# Altium schematic sheet Scaffold.SchDoc
size A3; SheetNumber: 1; SheetTotal: 7
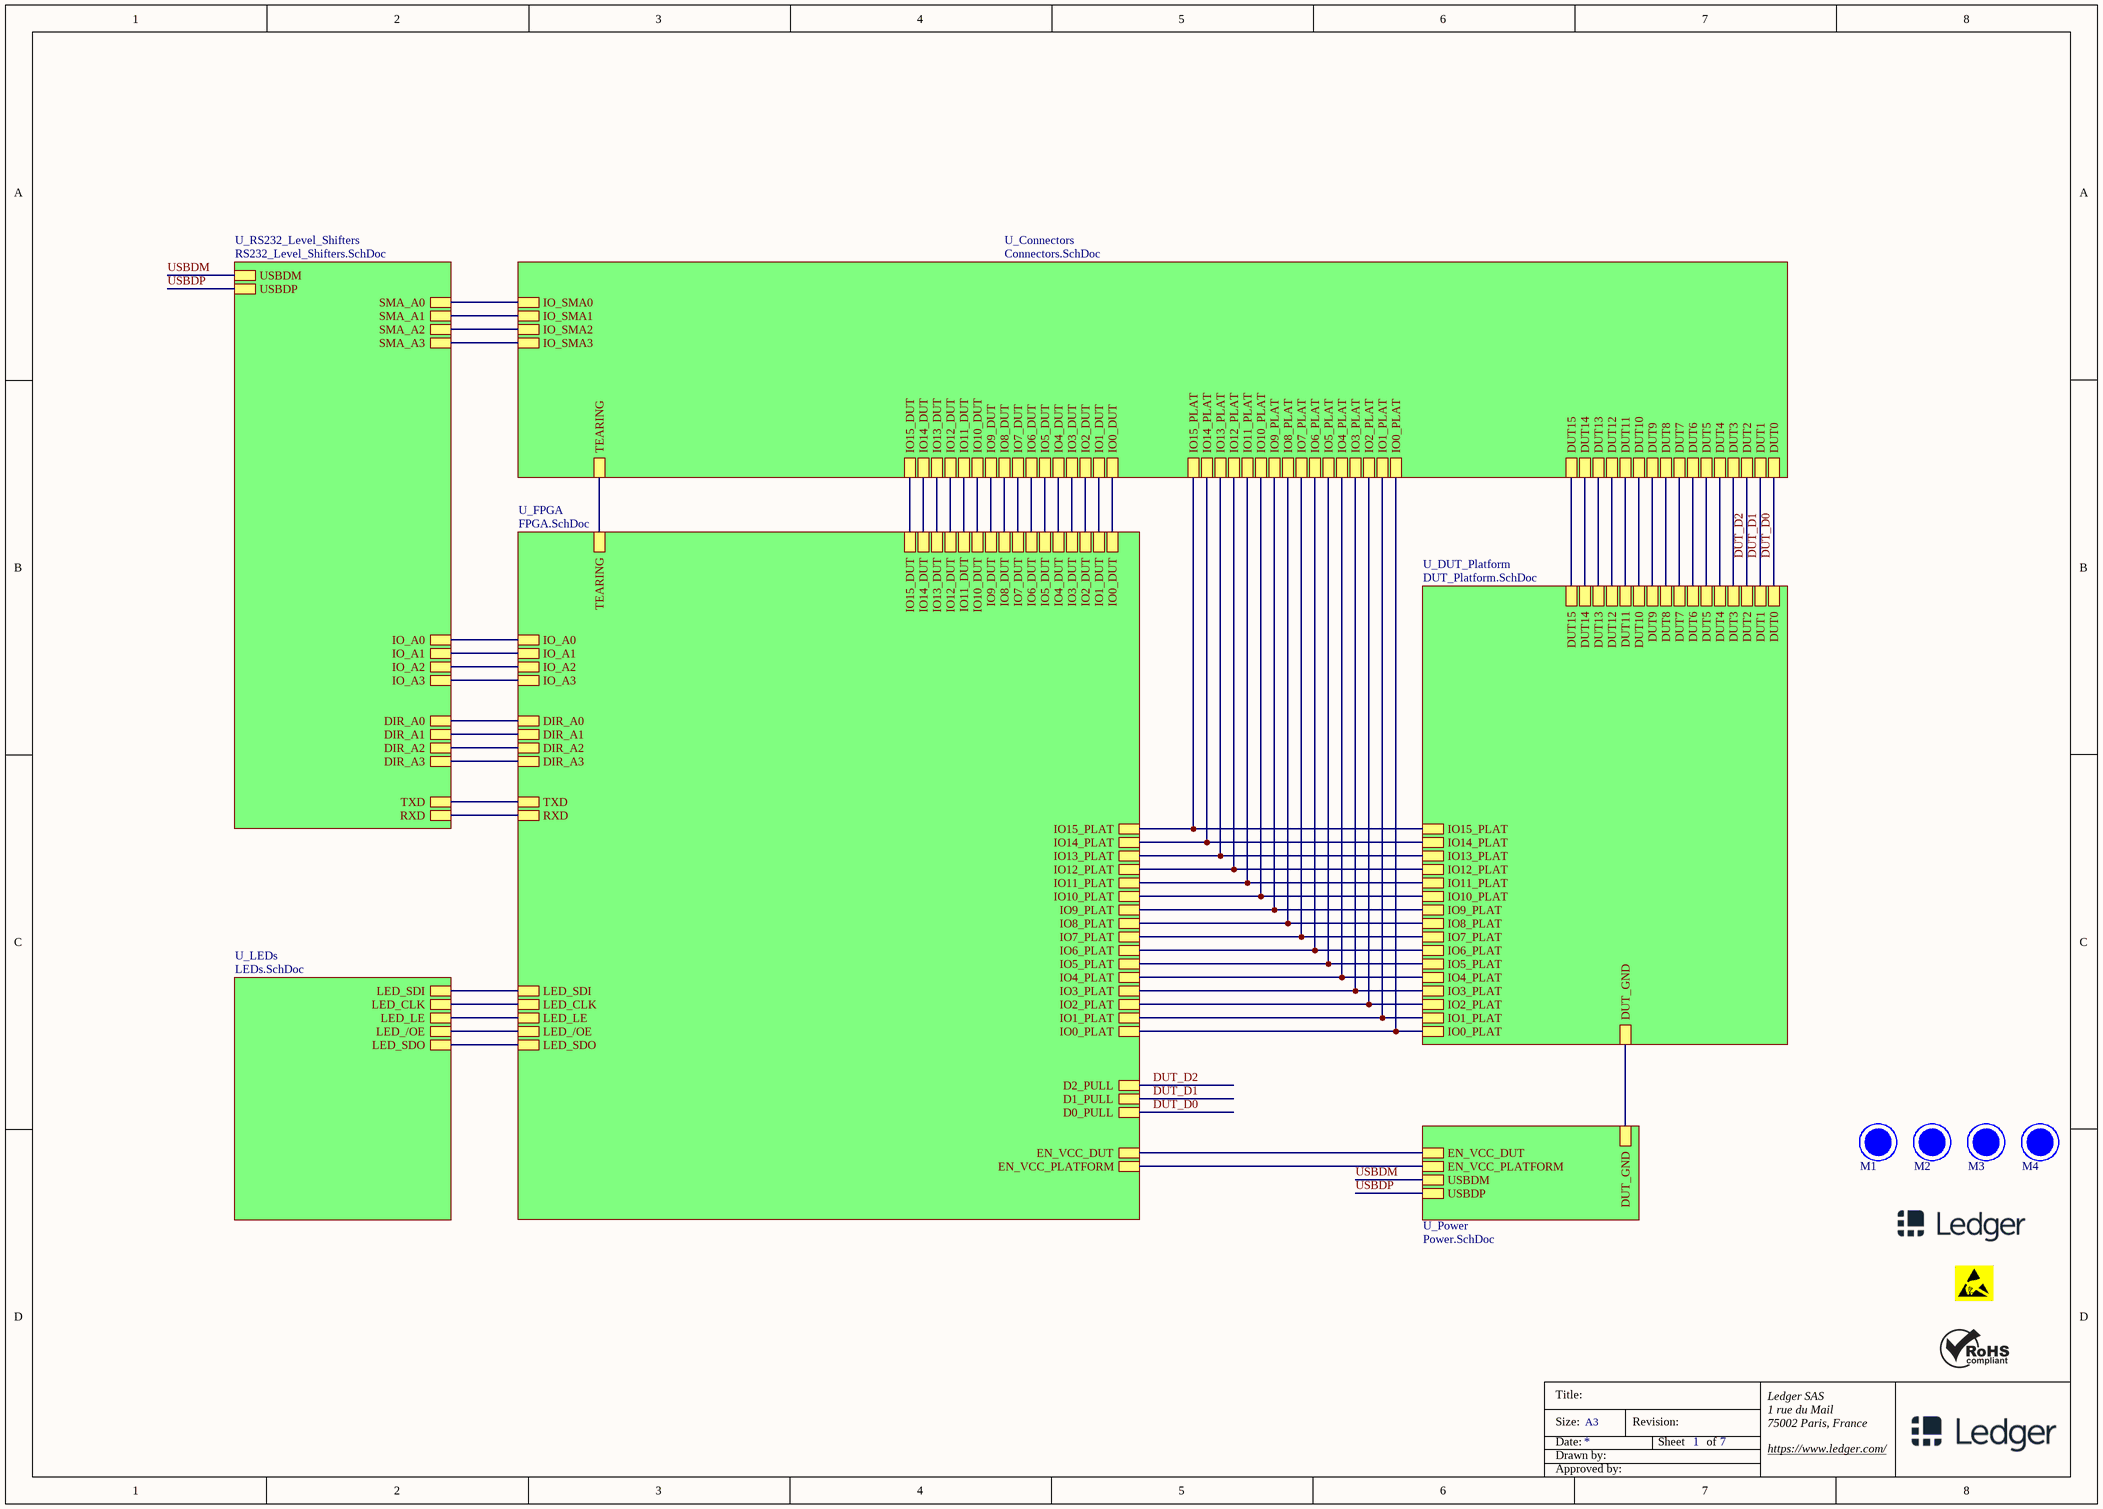
[diagram p0: Scaffold.SchDoc]

## Parts
Logo1  Logo Ledger  [logo_Ledger_new - Horizontale]  (value not drawn)  (no BOM)
Logo2  Logo ESD  [LOGO ESD]  (value not drawn)  (no BOM)
Logo3  Logo ROHS  [Logo ROHS]  (value not drawn)  (no BOM)
M1  Mire  [MIRE]  (value not drawn)  (no BOM)
M2  Mire  [MIRE]  (value not drawn)  (no BOM)
M3  Mire  [MIRE]  (value not drawn)  (no BOM)
M4  Mire  [MIRE]  (value not drawn)  (no BOM)

## Sub-sheets
U_Connectors = Connectors.SchDoc: IO_SMA1, IO_SMA0, IO_SMA3, IO_SMA2, TEARING, DUT3, DUT2, DUT1, DUT0, DUT5, DUT6, DUT7, IO3_DUT, IO2_DUT, IO1_DUT, IO0_DUT, IO4_DUT, IO5_DUT, IO6_DUT, IO7_DUT, DUT11, DUT10, DUT9, DUT8, DUT12, DUT13, DUT14, DUT15, IO11_DUT, IO10_DUT, IO9_DUT, IO8_DUT, IO12_DUT, IO13_DUT, IO14_DUT, IO15_DUT, IO8_PLAT, IO10_PLAT, IO12_PLAT, IO14_PLAT, IO9_PLAT, IO11_PLAT, IO13_PLAT, IO15_PLAT, IO0_PLAT, IO2_PLAT, IO4_PLAT, IO6_PLAT, IO1_PLAT, IO3_PLAT, IO5_PLAT, IO7_PLAT, DUT4
U_DUT_Platform = DUT_Platform.SchDoc: IO15_PLAT, IO14_PLAT, IO13_PLAT, IO12_PLAT, IO11_PLAT, IO10_PLAT, IO9_PLAT, IO8_PLAT, IO7_PLAT, IO6_PLAT, IO5_PLAT, IO4_PLAT, IO3_PLAT, IO2_PLAT, IO1_PLAT, IO0_PLAT, DUT7, DUT15, DUT14, DUT13, DUT12, DUT11, DUT10, DUT9, DUT8, DUT6, DUT5, DUT4, DUT3, DUT2, DUT1, DUT0, DUT_GND
U_FPGA = FPGA.SchDoc: EN_VCC_PLATFORM, EN_VCC_DUT, IO_A0, IO_A1, IO_A2, IO_A3, TEARING, LED_SDI, LED_CLK, LED_LE, LED_/OE, LED_SDO, IO0_DUT, IO0_PLAT, IO1_DUT, IO1_PLAT, IO2_DUT, IO2_PLAT, IO3_DUT, IO3_PLAT, IO11_DUT, IO11_PLAT, IO12_DUT, IO12_PLAT, IO13_DUT, IO13_PLAT, IO14_DUT, IO14_PLAT, IO15_DUT, IO15_PLAT, IO7_DUT, IO7_PLAT, IO8_DUT, IO8_PLAT, IO9_DUT, IO9_PLAT, IO10_DUT, IO10_PLAT, IO4_DUT, IO4_PLAT, IO5_DUT, IO5_PLAT, IO6_DUT, IO6_PLAT, RXD, TXD, DIR_A1, DIR_A0, DIR_A2, DIR_A3, D2_PULL, D1_PULL, D0_PULL
U_LEDs = LEDs.SchDoc: LED_SDI, LED_CLK, LED_/OE, LED_LE, LED_SDO
U_Power = Power.SchDoc: DUT_GND, EN_VCC_DUT, EN_VCC_PLATFORM, USBDM, USBDP
U_RS232_Level_Shifters = RS232_Level_Shifters.SchDoc: USBDM, USBDP, SMA_A0, SMA_A1, RXD, TXD, IO_A0, IO_A1, IO_A2, SMA_A2, IO_A3, SMA_A3, DIR_A1, DIR_A0, DIR_A2, DIR_A3

## Nets
DUT_D0: sheet U_FPGA/D0_PULL, sheet U_DUT_Platform/DUT0, sheet U_Connectors/DUT0
DUT_D1: sheet U_FPGA/D1_PULL, sheet U_DUT_Platform/DUT1, sheet U_Connectors/DUT1
DUT_D2: sheet U_FPGA/D2_PULL, sheet U_DUT_Platform/DUT2, sheet U_Connectors/DUT2
USBDM: sheet U_Power/USBDM, sheet U_RS232_Level_Shifters/USBDM
USBDP: sheet U_Power/USBDP, sheet U_RS232_Level_Shifters/USBDP
(unnamed): sheet U_Power/DUT_GND, sheet U_DUT_Platform/DUT_GND
(unnamed): sheet U_Power/EN_VCC_DUT, sheet U_FPGA/EN_VCC_DUT
(unnamed): sheet U_Power/EN_VCC_PLATFORM, sheet U_FPGA/EN_VCC_PLATFORM
(unnamed): sheet U_LEDs/LED_SDI, sheet U_FPGA/LED_SDI
(unnamed): sheet U_LEDs/LED_CLK, sheet U_FPGA/LED_CLK
(unnamed): sheet U_LEDs/LED_/OE, sheet U_FPGA/LED_/OE
(unnamed): sheet U_LEDs/LED_LE, sheet U_FPGA/LED_LE
(unnamed): sheet U_LEDs/LED_SDO, sheet U_FPGA/LED_SDO
(unnamed): sheet U_FPGA/IO_A0, sheet U_RS232_Level_Shifters/IO_A0
(unnamed): sheet U_FPGA/IO_A1, sheet U_RS232_Level_Shifters/IO_A1
(unnamed): sheet U_FPGA/IO_A2, sheet U_RS232_Level_Shifters/IO_A2
(unnamed): sheet U_FPGA/IO_A3, sheet U_RS232_Level_Shifters/IO_A3
(unnamed): sheet U_FPGA/TEARING, sheet U_Connectors/TEARING
(unnamed): sheet U_FPGA/IO0_DUT, sheet U_Connectors/IO0_DUT
(unnamed): sheet U_FPGA/IO0_PLAT, sheet U_DUT_Platform/IO0_PLAT, sheet U_Connectors/IO0_PLAT
(unnamed): sheet U_FPGA/IO1_DUT, sheet U_Connectors/IO1_DUT
(unnamed): sheet U_FPGA/IO1_PLAT, sheet U_DUT_Platform/IO1_PLAT, sheet U_Connectors/IO1_PLAT
(unnamed): sheet U_FPGA/IO2_DUT, sheet U_Connectors/IO2_DUT
(unnamed): sheet U_FPGA/IO2_PLAT, sheet U_DUT_Platform/IO2_PLAT, sheet U_Connectors/IO2_PLAT
(unnamed): sheet U_FPGA/IO3_DUT, sheet U_Connectors/IO3_DUT
(unnamed): sheet U_FPGA/IO3_PLAT, sheet U_DUT_Platform/IO3_PLAT, sheet U_Connectors/IO3_PLAT
(unnamed): sheet U_FPGA/IO11_DUT, sheet U_Connectors/IO11_DUT
(unnamed): sheet U_FPGA/IO11_PLAT, sheet U_DUT_Platform/IO11_PLAT, sheet U_Connectors/IO11_PLAT
(unnamed): sheet U_FPGA/IO12_DUT, sheet U_Connectors/IO12_DUT
(unnamed): sheet U_FPGA/IO12_PLAT, sheet U_DUT_Platform/IO12_PLAT, sheet U_Connectors/IO12_PLAT
(unnamed): sheet U_FPGA/IO13_DUT, sheet U_Connectors/IO13_DUT
(unnamed): sheet U_FPGA/IO13_PLAT, sheet U_DUT_Platform/IO13_PLAT, sheet U_Connectors/IO13_PLAT
(unnamed): sheet U_FPGA/IO14_DUT, sheet U_Connectors/IO14_DUT
(unnamed): sheet U_FPGA/IO14_PLAT, sheet U_DUT_Platform/IO14_PLAT, sheet U_Connectors/IO14_PLAT
(unnamed): sheet U_FPGA/IO15_DUT, sheet U_Connectors/IO15_DUT
(unnamed): sheet U_FPGA/IO15_PLAT, sheet U_DUT_Platform/IO15_PLAT, sheet U_Connectors/IO15_PLAT
(unnamed): sheet U_FPGA/IO7_DUT, sheet U_Connectors/IO7_DUT
(unnamed): sheet U_FPGA/IO7_PLAT, sheet U_DUT_Platform/IO7_PLAT, sheet U_Connectors/IO7_PLAT
(unnamed): sheet U_FPGA/IO8_DUT, sheet U_Connectors/IO8_DUT
(unnamed): sheet U_FPGA/IO8_PLAT, sheet U_DUT_Platform/IO8_PLAT, sheet U_Connectors/IO8_PLAT
(unnamed): sheet U_FPGA/IO9_DUT, sheet U_Connectors/IO9_DUT
(unnamed): sheet U_FPGA/IO9_PLAT, sheet U_DUT_Platform/IO9_PLAT, sheet U_Connectors/IO9_PLAT
(unnamed): sheet U_FPGA/IO10_DUT, sheet U_Connectors/IO10_DUT
(unnamed): sheet U_FPGA/IO10_PLAT, sheet U_DUT_Platform/IO10_PLAT, sheet U_Connectors/IO10_PLAT
(unnamed): sheet U_FPGA/IO4_DUT, sheet U_Connectors/IO4_DUT
(unnamed): sheet U_FPGA/IO4_PLAT, sheet U_DUT_Platform/IO4_PLAT, sheet U_Connectors/IO4_PLAT
(unnamed): sheet U_FPGA/IO5_DUT, sheet U_Connectors/IO5_DUT
(unnamed): sheet U_FPGA/IO5_PLAT, sheet U_DUT_Platform/IO5_PLAT, sheet U_Connectors/IO5_PLAT
(unnamed): sheet U_FPGA/IO6_DUT, sheet U_Connectors/IO6_DUT
(unnamed): sheet U_FPGA/IO6_PLAT, sheet U_DUT_Platform/IO6_PLAT, sheet U_Connectors/IO6_PLAT
(unnamed): sheet U_FPGA/RXD, sheet U_RS232_Level_Shifters/RXD
(unnamed): sheet U_FPGA/TXD, sheet U_RS232_Level_Shifters/TXD
(unnamed): sheet U_FPGA/DIR_A1, sheet U_RS232_Level_Shifters/DIR_A1
(unnamed): sheet U_FPGA/DIR_A0, sheet U_RS232_Level_Shifters/DIR_A0
(unnamed): sheet U_FPGA/DIR_A2, sheet U_RS232_Level_Shifters/DIR_A2
(unnamed): sheet U_FPGA/DIR_A3, sheet U_RS232_Level_Shifters/DIR_A3
(unnamed): sheet U_DUT_Platform/DUT7, sheet U_Connectors/DUT7
(unnamed): sheet U_DUT_Platform/DUT15, sheet U_Connectors/DUT15
(unnamed): sheet U_DUT_Platform/DUT14, sheet U_Connectors/DUT14
(unnamed): sheet U_DUT_Platform/DUT13, sheet U_Connectors/DUT13
(unnamed): sheet U_DUT_Platform/DUT12, sheet U_Connectors/DUT12
(unnamed): sheet U_DUT_Platform/DUT11, sheet U_Connectors/DUT11
(unnamed): sheet U_DUT_Platform/DUT10, sheet U_Connectors/DUT10
(unnamed): sheet U_DUT_Platform/DUT9, sheet U_Connectors/DUT9
(unnamed): sheet U_DUT_Platform/DUT8, sheet U_Connectors/DUT8
(unnamed): sheet U_DUT_Platform/DUT6, sheet U_Connectors/DUT6
(unnamed): sheet U_DUT_Platform/DUT5, sheet U_Connectors/DUT5
(unnamed): sheet U_DUT_Platform/DUT4, sheet U_Connectors/DUT4
(unnamed): sheet U_DUT_Platform/DUT3, sheet U_Connectors/DUT3
(unnamed): sheet U_Connectors/IO_SMA1, sheet U_RS232_Level_Shifters/SMA_A1
(unnamed): sheet U_Connectors/IO_SMA0, sheet U_RS232_Level_Shifters/SMA_A0
(unnamed): sheet U_Connectors/IO_SMA3, sheet U_RS232_Level_Shifters/SMA_A3
(unnamed): sheet U_Connectors/IO_SMA2, sheet U_RS232_Level_Shifters/SMA_A2

## Notes on the sheet
- Title:
- Size:
- Date:
- Drawn by:
- A3
- Revision:
- Sheet
- of
- Ledger SAS
- 1 rue du Mail
- 75002 Paris, France
- https://www.ledger.com/
- Approved by:

## Library data of the parts
Logo1 = Misc - Logo Ledger: Misc -  Logo Ledger
Logo2 = Misc - Logo ESD: Misc -  Logo ESD
Logo3 = Misc - Logo ROHS: Misc -  Logo ROHS
M1-M4 = Misc - Mire: Misc -  Mire